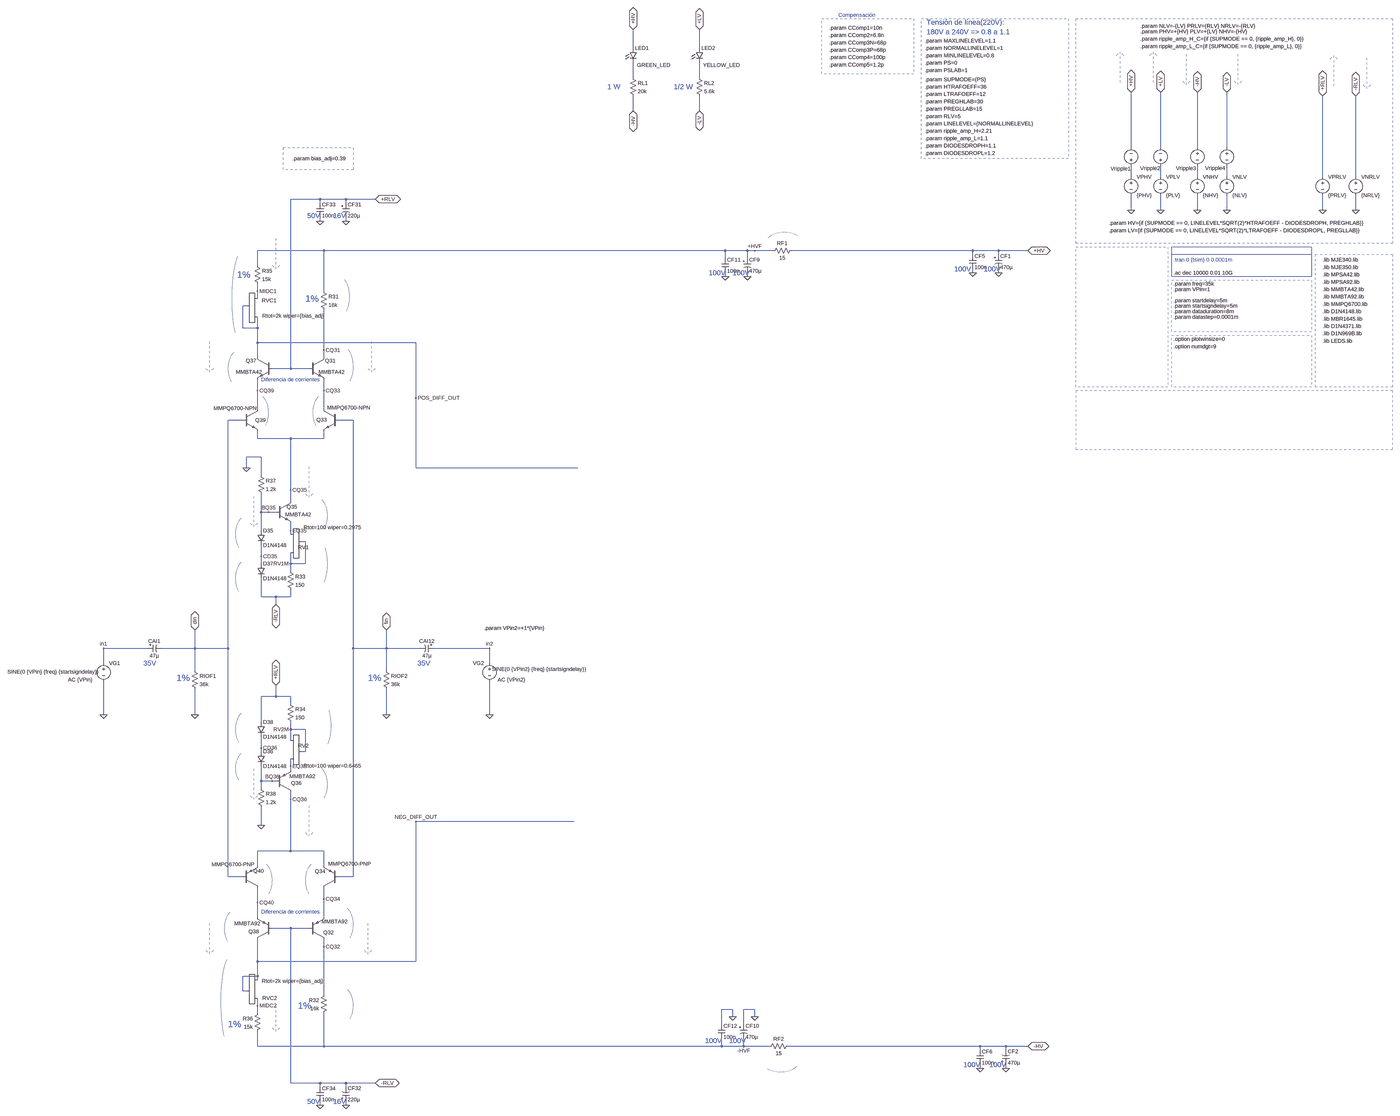
[diagram p0: schematic amplifier_V2.1_diff.asc, whole sheet]
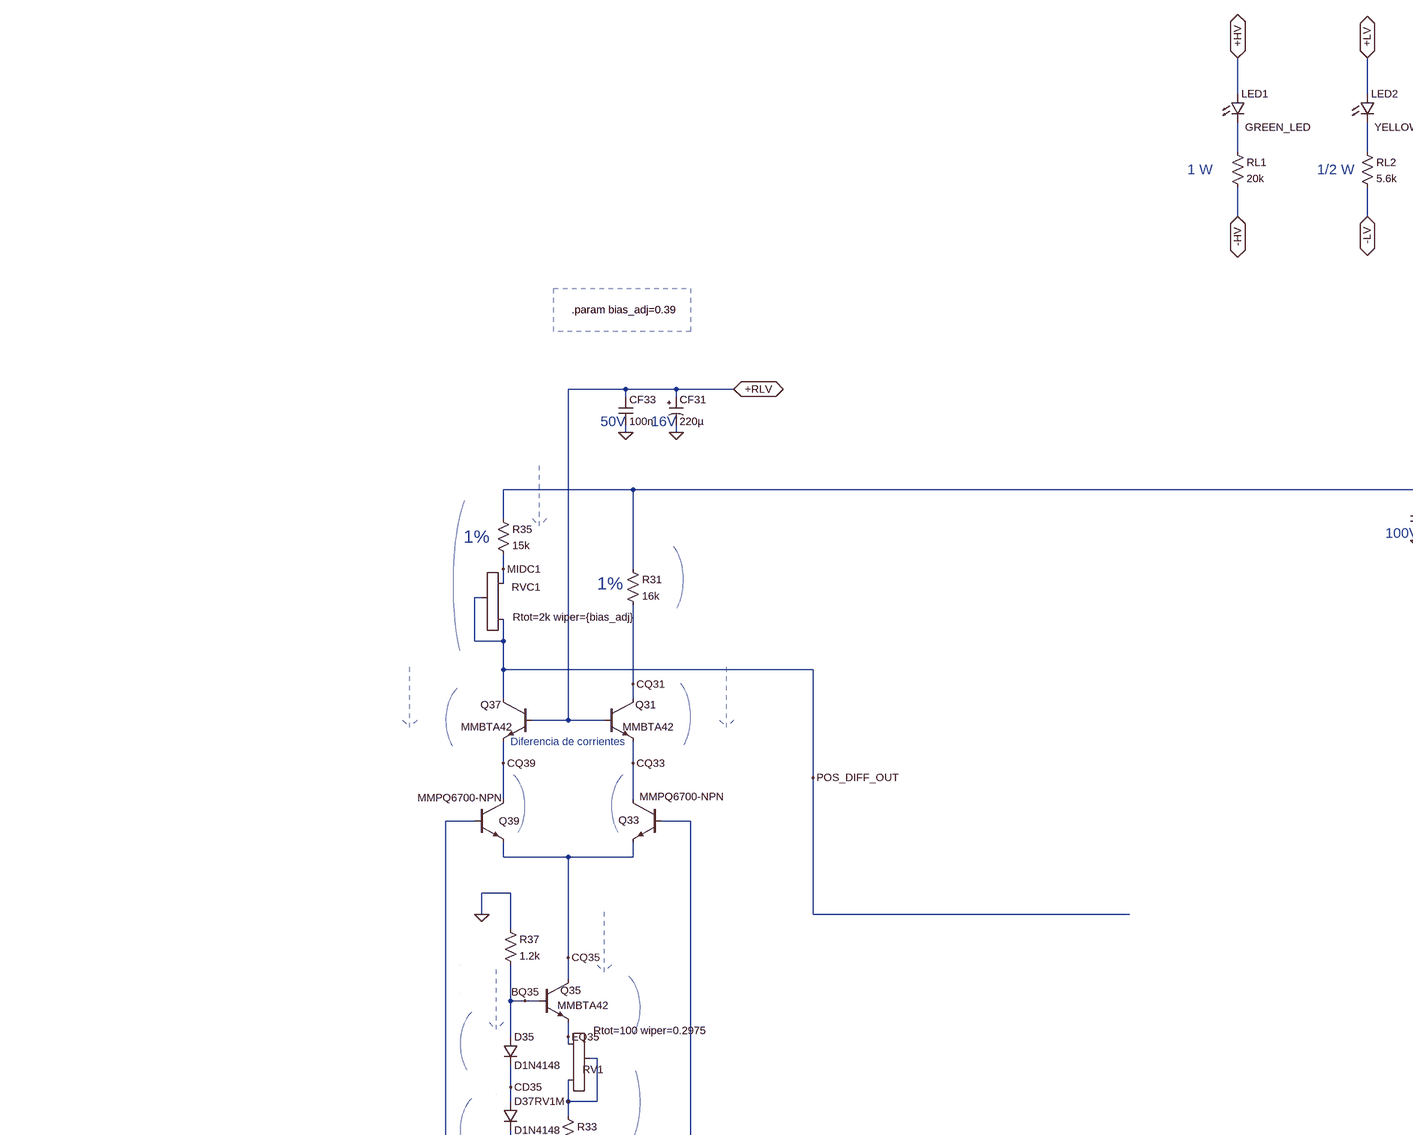
[diagram p1: schematic amplifier_V2.1_diff.asc, part, row 1 of 2, column 1 of 2]
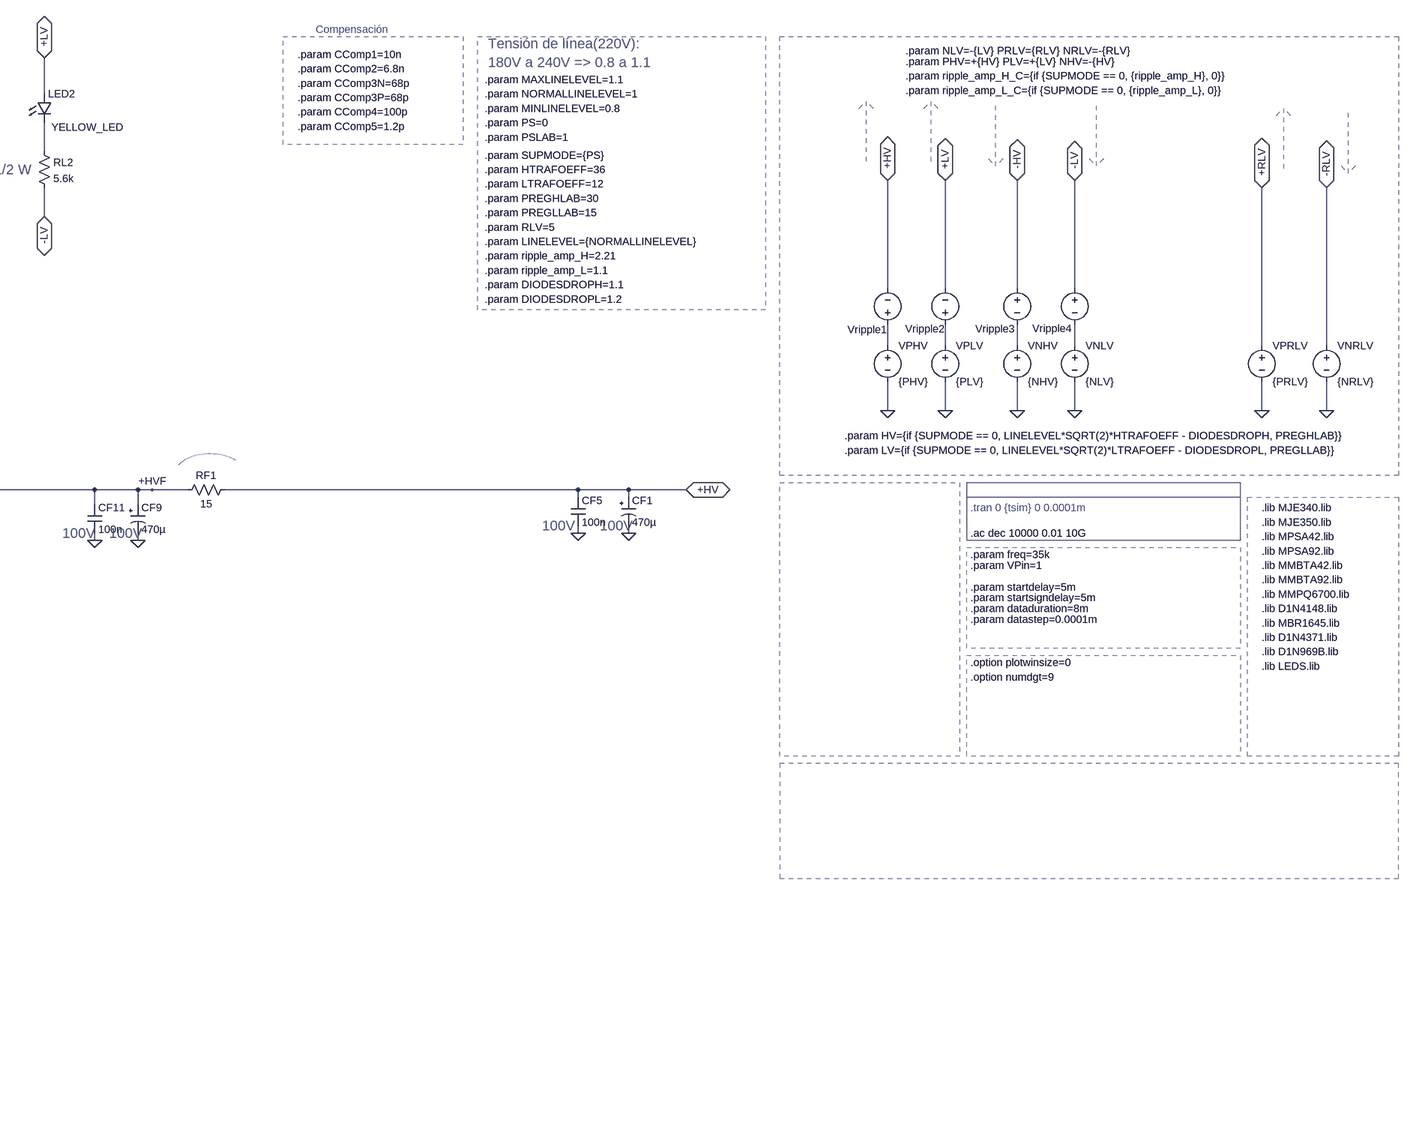
[diagram p2: schematic amplifier_V2.1_diff.asc, part, row 1 of 2, column 2 of 2]
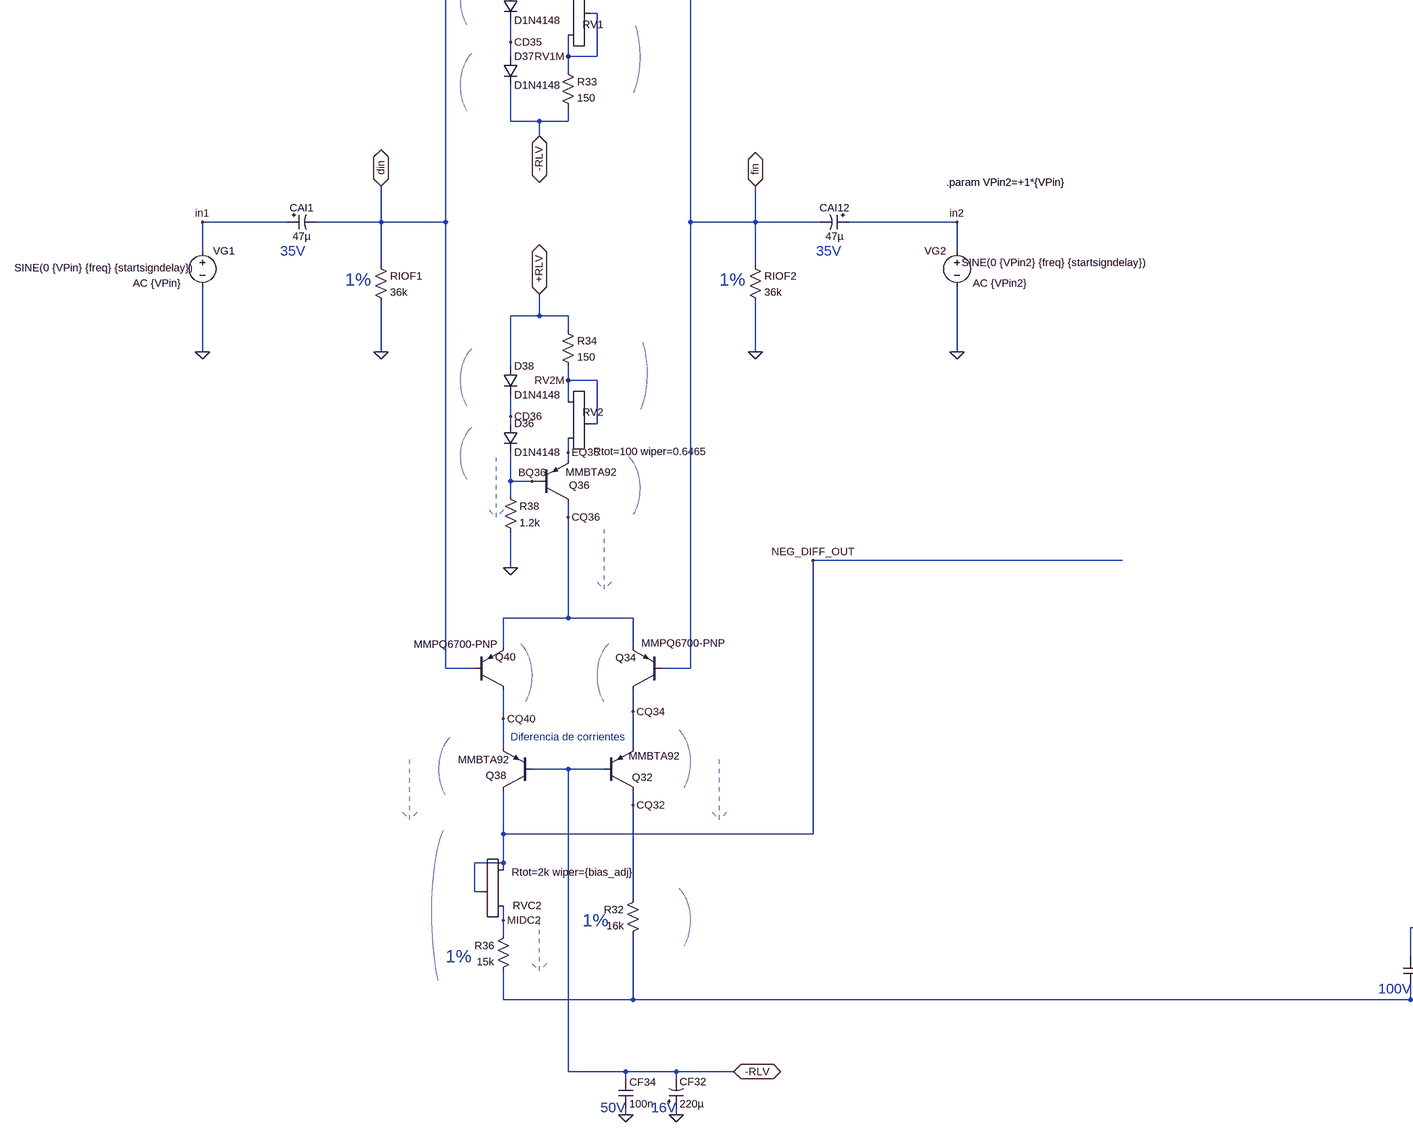
[diagram p3: schematic amplifier_V2.1_diff.asc, part, row 2 of 2, column 1 of 2]
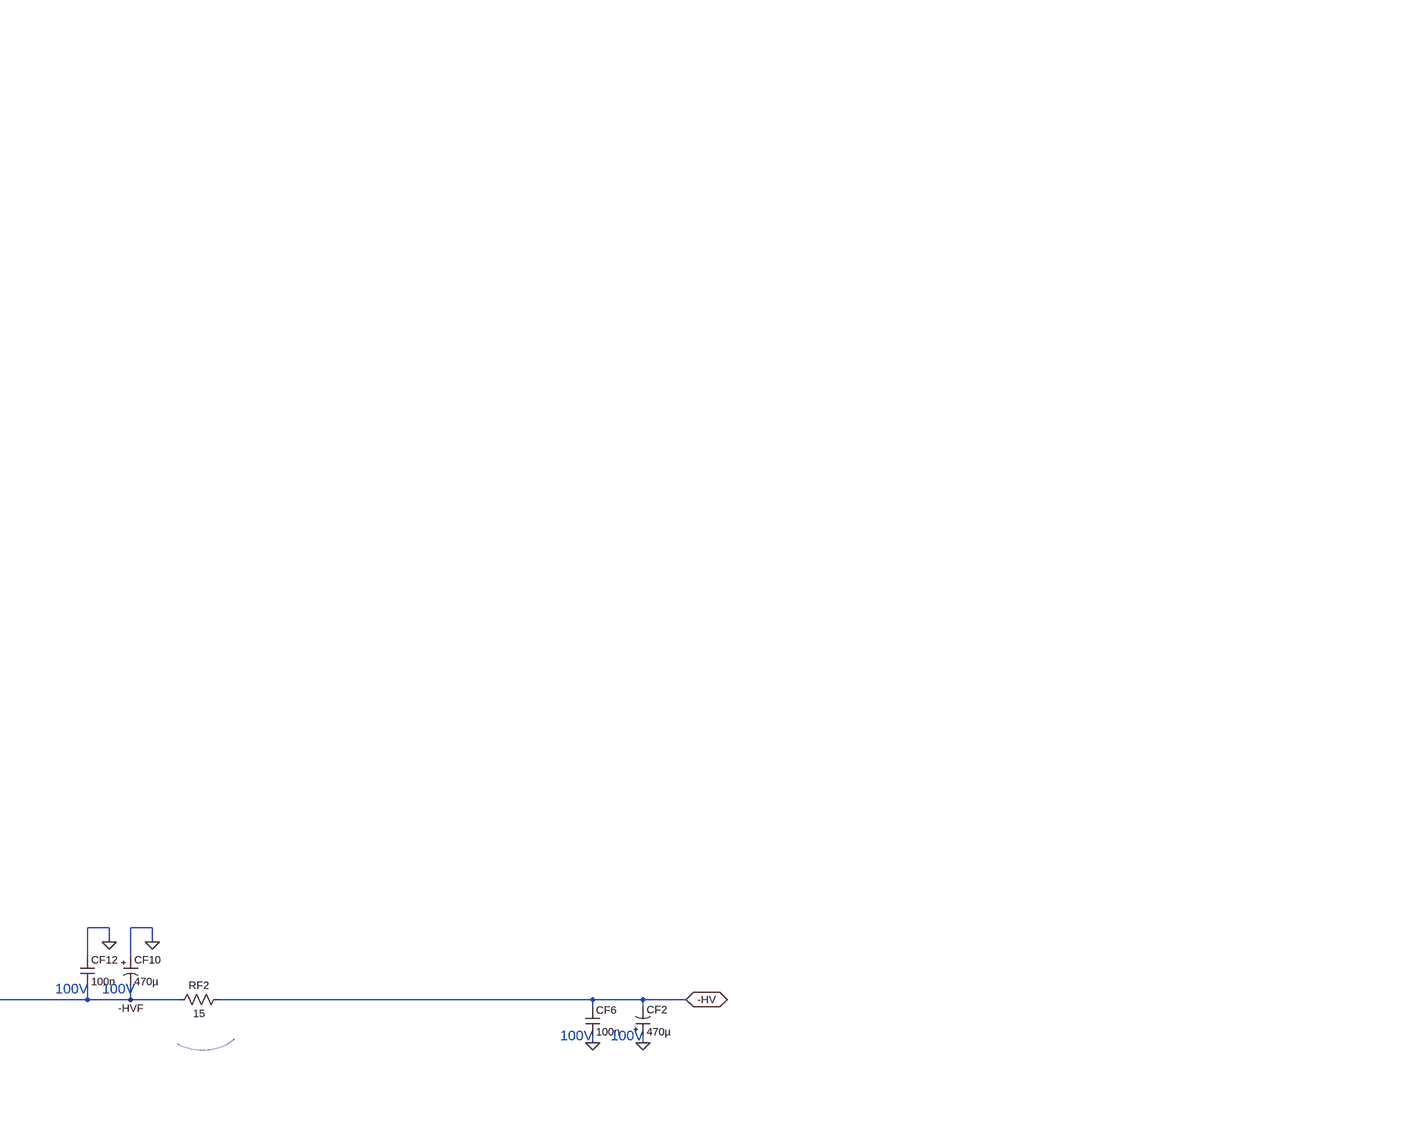
[diagram p4: schematic amplifier_V2.1_diff.asc, part, row 2 of 2, column 2 of 2]
amplifier_V2.1_diff.asc, the LTspice schematic file:
Version 4
SHEET 1 8052 2620
WIRE -528 -2480 -528 -2560
WIRE -240 -2480 -240 -2560
WIRE -528 -2352 -528 -2416
WIRE -240 -2352 -240 -2416
WIRE -528 -2208 -528 -2272
WIRE -240 -2208 -240 -2272
WIRE 1840 -2048 1840 -2288
WIRE 1968 -2048 1968 -2288
WIRE 2128 -2048 2128 -2288
WIRE 2256 -2048 2256 -2288
WIRE 1840 -1920 1840 -1968
WIRE 1968 -1920 1968 -1968
WIRE 2128 -1920 2128 -1968
WIRE 2256 -1920 2256 -1968
WIRE 2672 -1920 2672 -2272
WIRE 2816 -1920 2816 -2272
WIRE -1888 -1824 -2016 -1824
WIRE -1776 -1824 -1888 -1824
WIRE -1648 -1824 -1776 -1824
WIRE -1888 -1808 -1888 -1824
WIRE -1776 -1808 -1776 -1824
WIRE 1840 -1776 1840 -1840
WIRE 1968 -1776 1968 -1840
WIRE 2128 -1776 2128 -1840
WIRE 2256 -1776 2256 -1840
WIRE 2672 -1776 2672 -1840
WIRE 2816 -1776 2816 -1840
WIRE -1888 -1728 -1888 -1744
WIRE -1776 -1728 -1776 -1744
WIRE -1872 -1600 -2160 -1600
WIRE -128 -1600 -1872 -1600
WIRE -32 -1600 -128 -1600
WIRE 0 -1600 -32 -1600
WIRE 80 -1600 0 -1600
WIRE 1152 -1600 160 -1600
WIRE 1264 -1600 1152 -1600
WIRE 1392 -1600 1264 -1600
WIRE 1152 -1584 1152 -1600
WIRE 1264 -1584 1264 -1600
WIRE -128 -1568 -128 -1600
WIRE -32 -1568 -32 -1600
WIRE -2160 -1536 -2160 -1600
WIRE 1152 -1504 1152 -1520
WIRE 1264 -1504 1264 -1520
WIRE -128 -1488 -128 -1504
WIRE -32 -1488 -32 -1504
WIRE -2160 -1424 -2160 -1456
WIRE -1872 -1424 -1872 -1600
WIRE -2160 -1392 -2160 -1424
WIRE -2208 -1360 -2224 -1360
WIRE -2224 -1264 -2224 -1360
WIRE -2160 -1264 -2160 -1312
WIRE -2160 -1264 -2224 -1264
WIRE -2160 -1200 -2160 -1264
WIRE -1472 -1200 -2160 -1200
WIRE -1872 -1168 -1872 -1344
WIRE -2160 -1136 -2160 -1200
WIRE -1872 -1136 -1872 -1168
WIRE -2016 -1088 -2016 -1824
WIRE -2016 -1088 -2096 -1088
WIRE -1936 -1088 -2016 -1088
WIRE -2160 -992 -2160 -1040
WIRE -1872 -992 -1872 -1040
WIRE -1472 -960 -1472 -1200
WIRE -2160 -912 -2160 -992
WIRE -1872 -912 -1872 -992
WIRE -2224 -864 -2288 -864
WIRE -1744 -864 -1808 -864
WIRE -2160 -784 -2160 -816
WIRE -2016 -784 -2160 -784
WIRE -1872 -784 -1872 -816
WIRE -1872 -784 -2016 -784
WIRE -2144 -704 -2208 -704
WIRE -2208 -656 -2208 -704
WIRE -1472 -656 -1472 -960
WIRE -768 -656 -1472 -656
WIRE -2144 -624 -2144 -704
WIRE -2016 -560 -2016 -784
WIRE -2016 -512 -2016 -560
WIRE -2144 -464 -2144 -544
WIRE -2112 -464 -2144 -464
WIRE -2080 -464 -2112 -464
WIRE -2144 -384 -2144 -464
WIRE -2016 -384 -2016 -416
WIRE -2016 -368 -2016 -384
WIRE -1952 -336 -1968 -336
WIRE -2144 -272 -2144 -320
WIRE -2144 -240 -2144 -272
WIRE -2016 -240 -2016 -288
WIRE -1952 -240 -1952 -336
WIRE -1952 -240 -2016 -240
WIRE -2016 -208 -2016 -240
WIRE -2144 -96 -2144 -176
WIRE -2080 -96 -2144 -96
WIRE -2016 -96 -2016 -128
WIRE -2016 -96 -2080 -96
WIRE -2080 -64 -2080 -96
WIRE -2640 128 -2912 128
WIRE -2432 128 -2432 48
WIRE -2432 128 -2576 128
WIRE -2288 128 -2288 -864
WIRE -2288 128 -2432 128
WIRE -1744 128 -1744 -864
WIRE -1600 128 -1600 48
WIRE -1600 128 -1744 128
WIRE -1456 128 -1600 128
WIRE -1152 128 -1392 128
WIRE -2912 192 -2912 128
WIRE -1152 192 -1152 128
WIRE -2432 224 -2432 128
WIRE -1600 224 -1600 128
WIRE -2080 336 -2080 288
WIRE -2080 336 -2144 336
WIRE -2016 336 -2080 336
WIRE -2016 368 -2016 336
WIRE -2912 416 -2912 272
WIRE -2432 416 -2432 304
WIRE -1600 416 -1600 304
WIRE -1152 416 -1152 272
WIRE -2144 448 -2144 336
WIRE -2016 480 -2016 448
WIRE -1952 480 -2016 480
WIRE -2016 528 -2016 480
WIRE -2144 560 -2144 512
WIRE -2144 576 -2144 560
WIRE -1952 576 -1952 480
WIRE -1952 576 -1968 576
WIRE -2016 640 -2016 608
WIRE -2016 656 -2016 640
WIRE -2144 704 -2144 640
WIRE -2096 704 -2144 704
WIRE -2080 704 -2096 704
WIRE -2144 736 -2144 704
WIRE -2016 784 -2016 752
WIRE -784 880 -1472 880
WIRE -2144 896 -2144 816
WIRE -2016 1008 -2016 784
WIRE -2016 1008 -2160 1008
WIRE -1872 1008 -2016 1008
WIRE -2160 1072 -2160 1008
WIRE -1872 1072 -1872 1008
WIRE -2288 1120 -2288 128
WIRE -2224 1120 -2288 1120
WIRE -1744 1120 -1744 128
WIRE -1744 1120 -1808 1120
WIRE -1872 1216 -1872 1168
WIRE -2160 1232 -2160 1168
WIRE -2160 1296 -2160 1232
WIRE -1872 1296 -1872 1216
WIRE -2016 1344 -2096 1344
WIRE -1936 1344 -2016 1344
WIRE -1872 1424 -1872 1392
WIRE -2160 1488 -2160 1392
WIRE -1472 1488 -1472 880
WIRE -1472 1488 -2160 1488
WIRE -2160 1552 -2160 1488
WIRE -2160 1552 -2224 1552
WIRE -2160 1568 -2160 1552
WIRE -2224 1616 -2224 1552
WIRE -2208 1616 -2224 1616
WIRE -1872 1632 -1872 1424
WIRE -2160 1680 -2160 1648
WIRE -96 1696 -144 1696
WIRE 0 1696 -48 1696
WIRE -2160 1712 -2160 1680
WIRE -96 1728 -96 1696
WIRE 0 1728 0 1696
WIRE -144 1760 -144 1696
WIRE -48 1760 -48 1696
WIRE -2160 1856 -2160 1792
WIRE -1872 1856 -1872 1712
WIRE -1872 1856 -2160 1856
WIRE -144 1856 -144 1824
WIRE -144 1856 -1872 1856
WIRE -48 1856 -48 1824
WIRE -48 1856 -144 1856
WIRE 64 1856 -48 1856
WIRE 1184 1856 144 1856
WIRE 1296 1856 1184 1856
WIRE 1392 1856 1296 1856
WIRE 1184 1872 1184 1856
WIRE 1296 1872 1296 1856
WIRE 1184 1952 1184 1936
WIRE 1296 1952 1296 1936
WIRE -2016 2016 -2016 1344
WIRE -1888 2016 -2016 2016
WIRE -1776 2016 -1888 2016
WIRE -1648 2016 -1776 2016
WIRE -1888 2032 -1888 2016
WIRE -1776 2032 -1776 2016
WIRE -1888 2112 -1888 2096
WIRE -1776 2112 -1776 2096
FLAG -2432 416 0
FLAG -1648 -1824 +RLV
IOPIN -1648 -1824 BiDir
FLAG -1648 2016 -RLV
IOPIN -1648 2016 BiDir
FLAG -2080 -64 -RLV
IOPIN -2080 -64 BiDir
FLAG -2080 288 +RLV
IOPIN -2080 288 BiDir
FLAG 1392 1856 -HV
IOPIN 1392 1856 BiDir
FLAG -2912 416 0
FLAG -2912 128 in1
FLAG 1264 -1504 0
FLAG -2144 896 0
FLAG -2208 -656 0
FLAG -1472 -960 POS_DIFF_OUT
FLAG -1472 880 NEG_DIFF_OUT
FLAG 1152 -1504 0
FLAG 1296 1952 0
FLAG 1184 1952 0
FLAG -1776 -1728 0
FLAG -1888 -1728 0
FLAG -1776 2112 0
FLAG -1888 2112 0
FLAG 1840 -1776 0
FLAG 1968 -1776 0
FLAG 2128 -1776 0
FLAG 2256 -1776 0
FLAG 1968 -2288 +LV
IOPIN 1968 -2288 BiDir
FLAG 2128 -2288 -HV
IOPIN 2128 -2288 BiDir
FLAG 2256 -2288 -LV
IOPIN 2256 -2288 BiDir
FLAG 2672 -1776 0
FLAG 2672 -2272 +RLV
IOPIN 2672 -2272 BiDir
FLAG 2816 -1776 0
FLAG 2816 -2272 -RLV
IOPIN 2816 -2272 BiDir
FLAG -2016 -560 CQ35
FLAG -2016 784 CQ36
FLAG -2144 -272 CD35
FLAG -2144 560 CD36
FLAG -2096 704 BQ36
FLAG -2432 48 din
IOPIN -2432 48 BiDir
FLAG -1600 48 fin
IOPIN -1600 48 BiDir
FLAG -2160 1232 CQ40
FLAG -2160 -992 CQ39
FLAG 1392 -1600 +HV
IOPIN 1392 -1600 BiDir
FLAG -240 -2560 +LV
IOPIN -240 -2560 BiDir
FLAG -240 -2208 -LV
IOPIN -240 -2208 BiDir
FLAG -528 -2560 +HV
IOPIN -528 -2560 BiDir
FLAG -528 -2208 -HV
IOPIN -528 -2208 BiDir
FLAG -1872 1216 CQ34
FLAG -1872 1424 CQ32
FLAG -1872 -992 CQ33
FLAG -1872 -1168 CQ31
FLAG 0 1728 0
FLAG -48 1856 -HVF
FLAG -32 -1488 0
FLAG 0 -1600 +HVF
FLAG 1840 -2288 +HV
IOPIN 1840 -2288 BiDir
FLAG -2016 -384 EQ35
FLAG -2016 640 EQ36
FLAG -128 -1488 0
FLAG -96 1728 0
FLAG -2016 -240 RV1M
FLAG -2016 480 RV2M
FLAG -2112 -464 BQ35
FLAG -2160 -1424 MIDC1
FLAG -2160 1680 MIDC2
FLAG -1152 416 0
FLAG -1152 128 in2
FLAG -1600 416 0
DATAFLAG -2016 -688 ""
DATAFLAG -2016 912 ""
DATAFLAG -1696 128 ""
DATAFLAG 1328 -1600 ""
DATAFLAG -2096 -96 ""
DATAFLAG -2032 336 ""
DATAFLAG -2320 128 ""
DATAFLAG 1312 1856 ""
DATAFLAG -1680 -1824 ""
DATAFLAG -1680 2016 ""
DATAFLAG -2368 -1168 "Ic(Q37)"
DATAFLAG -2176 -496 "I(D35)"
DATAFLAG -2176 688 "I(D36)"
DATAFLAG -1936 -624 "Ic(Q35)"
DATAFLAG -1936 848 "-Ic(Q36)"
DATAFLAG -2368 1392 "-Ic(Q40)"
DATAFLAG 1792 -2368 "-I(Vphv)"
DATAFLAG 1936 -2416 "-I(Vplv)"
DATAFLAG 2080 -2368 "I(vnhv)"
DATAFLAG 2864 -2400 "I(Vnrlv)"
DATAFLAG 2720 -2400 "-I(Vprlv)"
DATAFLAG 2304 -2416 "I(Vnlv)"
DATAFLAG -2288 -1088 "V(POS_DIFF_OUT)-V(CQ39)"
DATAFLAG -2112 -880 "V(CQ39)-V(CQ35)"
DATAFLAG -1920 -880 "V(CQ33)-V(CQ35)"
DATAFLAG -1856 -448 "V(CQ35)-V(EQ35)"
DATAFLAG -1856 720 "V(EQ36)-V(CQ36)"
DATAFLAG -2256 -176 "V(CD35)-V(-rlv)"
DATAFLAG -2256 -368 "V(BQ35)-V(CD35)"
DATAFLAG -2256 480 "V(+rlv)-V(CD36)"
DATAFLAG -2256 640 "V(CD36)-V(BQ36)"
DATAFLAG -2096 1136 "-V(CQ40)+V(CQ36)"
DATAFLAG -1952 1136 "-V(CQ34)+V(CQ36)"
DATAFLAG -2304 1344 "V(CQ40)-V(NEG_DIFF_OUT)"
DATAFLAG -2320 1664 "V(NEG_DIFF_OUT)-V(-HVF)"
DATAFLAG -2272 -1520 "V(+HVF)-V(POS_DIFF_OUT)"
DATAFLAG -2016 -992 "Ic(Q37)-Ic(Q31)"
DATAFLAG -2016 1312 "Ic(Q38)-Ic(Q32)"
DATAFLAG -1680 1360 "-Ic(Q34)"
DATAFLAG -2080 -1616 "I(R35)"
DATAFLAG -2080 1728 "-I(R36)"
DATAFLAG -1952 1344 ""
DATAFLAG -304 -1600 ""
DATAFLAG -304 1856 ""
DATAFLAG -1728 1856 ""
DATAFLAG -1744 -1600 ""
DATAFLAG 112 1968 "-V(-HV)+V(-HVF)"
DATAFLAG -656 1856 ""
DATAFLAG -640 -1600 ""
DATAFLAG 128 -1680 "V(+HV)-V(+HVF)"
DATAFLAG -2752 128 ""
DATAFLAG -1664 -1168 "Ic(Q31)"
DATAFLAG -1744 -1088 "V(CQ31)-V(CQ33)"
DATAFLAG -1744 1328 "V(CQ34)-V(CQ32)"
DATAFLAG -1744 1696 "V(CQ32)-V(-HVF)"
DATAFLAG -1760 -1440 "V(+HVF)-V(CQ31)"
DATAFLAG -1856 -240 "V(EQ35)-V(-rlv)"
DATAFLAG -1840 464 "-V(EQ36)+V(+rlv)"
DATAFLAG -1312 128 ""
SYMBOL res -2448 208 R0
SYMATTR InstName RIOF1
SYMATTR Value 36k
SYMBOL npn -2224 -912 R0
WINDOW 3 -127 -3 Left 2
WINDOW 0 54 48 Left 2
SYMATTR Value MMPQ6700-NPN
SYMATTR InstName Q39
SYMBOL npn -1808 -912 M0
WINDOW 0 50 47 Left 2
WINDOW 3 -138 -6 Left 2
SYMATTR InstName Q33
SYMATTR Value MMPQ6700-NPN
SYMBOL pnp -2224 1168 M180
WINDOW 3 -135 102 Left 2
WINDOW 0 46 73 Left 2
SYMATTR Value MMPQ6700-PNP
SYMATTR InstName Q40
SYMBOL pnp -1808 1168 R180
WINDOW 0 57 72 Left 2
WINDOW 3 -141 104 Left 2
SYMATTR InstName Q34
SYMATTR Value MMPQ6700-PNP
SYMBOL res -2160 -640 R0
SYMATTR InstName R37
SYMATTR Value 1.2k
SYMBOL npn -2080 -512 R0
WINDOW 0 47 25 Left 2
WINDOW 3 40 58 Left 2
SYMATTR InstName Q35
SYMATTR Value MMBTA42
SYMBOL pnp -2080 752 M180
WINDOW 0 66 39 Left 2
WINDOW 3 58 68 Left 2
SYMATTR InstName Q36
SYMATTR Value MMBTA92
SYMBOL res -2160 720 R0
SYMATTR InstName R38
SYMATTR Value 1.2k
SYMBOL voltage -2912 176 R0
WINDOW 3 -418 54 Left 2
WINDOW 123 -155 88 Left 2
WINDOW 39 0 0 Left 2
SYMATTR Value SINE(0 {VPin} {freq} {startsigndelay})
SYMATTR Value2 AC {VPin}
SYMATTR InstName VG1
SYMBOL cap 1136 -1584 R0
SYMATTR InstName CF5
SYMATTR Value 100n
SYMBOL diode -2160 448 R0
SYMATTR InstName D38
SYMATTR Value D1N4148
SYMBOL diode -2160 -384 R0
SYMATTR InstName D35
SYMATTR Value D1N4148
SYMBOL polcap 1248 -1584 R0
SYMATTR InstName CF1
SYMATTR Value 470µ
SYMBOL cap 1168 1872 R0
SYMATTR InstName CF6
SYMATTR Value 100n
SYMBOL polcap 1280 1936 M180
WINDOW 0 24 57 Left 2
WINDOW 3 24 8 Left 2
SYMATTR InstName CF2
SYMATTR Value 470µ
SYMBOL cap -1904 -1808 R0
SYMATTR InstName CF33
SYMATTR Value 100n
SYMBOL polcap -1792 -1808 R0
SYMATTR InstName CF31
SYMATTR Value 220µ
SYMBOL cap -1904 2032 R0
SYMATTR InstName CF34
SYMATTR Value 100n
SYMBOL polcap -1792 2096 M180
WINDOW 0 24 57 Left 2
WINDOW 3 24 8 Left 2
SYMATTR InstName CF32
SYMATTR Value 220µ
SYMBOL polcap -2640 112 M90
WINDOW 0 0 32 VBottom 2
WINDOW 3 32 32 VTop 2
SYMATTR InstName CAI1
SYMATTR Value 47µ
SYMBOL voltage 1840 -1936 R0
SYMATTR InstName VPHV
SYMATTR Value {PHV}
SYMBOL voltage 1968 -1936 R0
SYMATTR InstName VPLV
SYMATTR Value {PLV}
SYMBOL voltage 2128 -1936 R0
SYMATTR InstName VNHV
SYMATTR Value {NHV}
SYMBOL voltage 2256 -1936 R0
SYMATTR InstName VNLV
SYMATTR Value {NLV}
SYMBOL voltage 2672 -1936 R0
SYMATTR InstName VPRLV
SYMATTR Value {PRLV}
SYMBOL voltage 2816 -1936 R0
SYMATTR InstName VNRLV
SYMATTR Value {NRLV}
SYMBOL npn -2096 -1136 M0
WINDOW 0 69 14 Left 2
WINDOW 3 44 63 Left 2
SYMATTR InstName Q37
SYMATTR Value MMBTA42
SYMBOL res -2176 -1552 R0
SYMATTR InstName R35
SYMATTR Value 15k
SYMBOL pnp -2096 1392 R180
WINDOW 0 57 34 Left 2
WINDOW 3 51 69 Left 2
SYMATTR InstName Q38
SYMATTR Value MMBTA92
SYMBOL res -2144 1696 M0
SYMATTR InstName R36
SYMATTR Value 15k
SYMBOL voltage 2256 -2064 R0
WINDOW 123 0 0 Left 0
WINDOW 39 0 0 Left 0
WINDOW 0 -94 105 Left 2
WINDOW 3 -94 77 Invisible 2
SYMATTR InstName Vripple4
SYMATTR Value PULSE({ripple_amp_L_C} 0 0 1m 9m 0 10m)
SYMBOL voltage 2128 -2064 R0
WINDOW 123 0 0 Left 0
WINDOW 39 0 0 Left 0
WINDOW 0 -93 106 Left 2
WINDOW 3 -93 78 Invisible 2
SYMATTR InstName Vripple3
SYMATTR Value PULSE({ripple_amp_H_C} 0 0 1m 9m 0 10m)
SYMBOL voltage 1840 -1952 R180
WINDOW 123 0 0 Left 0
WINDOW 39 0 0 Left 0
WINDOW 0 1 4 Left 2
WINDOW 3 1 -24 Invisible 2
SYMATTR InstName Vripple1
SYMATTR Value PULSE({ripple_amp_H_C} 0 0 1m 9m 0 10m)
SYMBOL voltage 1968 -1952 R180
WINDOW 123 0 0 Left 0
WINDOW 39 0 0 Left 0
WINDOW 0 0 6 Left 2
WINDOW 3 0 -22 Invisible 2
SYMATTR InstName Vripple2
SYMATTR Value PULSE({ripple_amp_L_C} 0 0 1m 9m 0 10m)
SYMBOL diode -2160 -240 R0
SYMATTR InstName D37
SYMATTR Value D1N4148
SYMBOL diode -2160 576 R0
SYMATTR InstName D36
SYMATTR Value D1N4148
SYMBOL npn -1936 -1136 R0
WINDOW 0 69 14 Left 2
WINDOW 3 41 63 Left 2
SYMATTR InstName Q31
SYMATTR Value MMBTA42
SYMBOL res -1888 -1440 R0
SYMATTR InstName R31
SYMATTR Value 16k
SYMBOL pnp -1936 1392 M180
WINDOW 0 62 30 Left 2
WINDOW 3 54 77 Left 2
SYMATTR InstName Q32
SYMATTR Value MMBTA92
SYMBOL res -1856 1616 M0
SYMATTR InstName R32
SYMATTR Value 16k
SYMBOL LED -256 -2480 R0
WINDOW 3 32 74 Left 2
SYMATTR Value YELLOW_LED
SYMATTR InstName LED2
SYMBOL res -256 -2368 R0
SYMATTR InstName RL2
SYMATTR Value 5.6k
SYMBOL LED -544 -2480 R0
WINDOW 3 32 74 Left 2
SYMATTR Value GREEN_LED
SYMATTR InstName LED1
SYMBOL res -544 -2368 R0
SYMATTR InstName RL1
SYMATTR Value 20k
SYMBOL res 160 1840 R90
WINDOW 0 0 56 VBottom 2
WINDOW 3 32 56 VTop 2
SYMATTR InstName RF2
SYMATTR Value 15
SYMBOL polcap -64 1760 R0
SYMATTR InstName CF10
SYMATTR Value 470µ
SYMBOL res 176 -1616 R90
WINDOW 0 0 56 VBottom 2
WINDOW 3 32 56 VTop 2
SYMATTR InstName RF1
SYMATTR Value 15
SYMBOL polcap -48 -1568 R0
SYMATTR InstName CF9
SYMATTR Value 470µ
SYMBOL potentiometer_standard -2032 -272 M180
WINDOW 0 48 39 Left 2
WINDOW 39 48 112 Invisible 2
WINDOW 38 48 114 Left 2
SYMATTR InstName RV1
SYMATTR SpiceLine Rtap=0 tap=0.5
SYMATTR Value Rtot=100 wiper=0.2975
SYMBOL res -2032 -224 R0
SYMATTR InstName R33
SYMATTR Value 150
SYMBOL potentiometer_standard -2032 512 R0
WINDOW 0 48 39 Left 2
WINDOW 39 48 112 Invisible 2
WINDOW 38 48 114 Left 2
SYMATTR InstName RV2
SYMATTR SpiceLine Rtap=0 tap=0.5
SYMATTR Value Rtot=100 wiper=0.6465
SYMBOL res -2032 352 R0
SYMATTR InstName R34
SYMATTR Value 150
SYMBOL cap -144 -1568 R0
SYMATTR InstName CF11
SYMATTR Value 100n
SYMBOL cap -160 1824 M180
WINDOW 0 24 56 Left 2
WINDOW 3 24 8 Left 2
SYMATTR InstName CF12
SYMATTR Value 100n
SYMBOL potentiometer_standard -2144 -1296 R180
WINDOW 0 -66 88 Left 2
WINDOW 39 48 112 Invisible 2
WINDOW 38 -83 56 Left 2
WINDOW 3 -274 21 Left 2
SYMATTR InstName RVC1
SYMATTR SpiceLine Rtap=0 tap=0.5
SYMATTR Value Rtot=2k wiper={bias_adj}
SYMBOL potentiometer_standard -2144 1552 M0
WINDOW 0 -69 95 Left 2
WINDOW 39 48 112 Invisible 2
WINDOW 38 -83 56 Left 2
WINDOW 3 -272 21 Left 2
SYMATTR InstName RVC2
SYMATTR SpiceLine Rtap=0 tap=0.5
SYMATTR Value Rtot=2k wiper={bias_adj}
SYMBOL voltage -1152 176 M0
WINDOW 3 -421 42 Left 2
WINDOW 123 -155 88 Left 2
WINDOW 39 0 0 Left 2
SYMATTR Value SINE(0 {VPin2} {freq} {startsigndelay})
SYMATTR Value2 AC {VPin2}
SYMATTR InstName VG2
SYMBOL polcap -1392 112 R90
WINDOW 0 0 32 VBottom 2
WINDOW 3 32 32 VTop 2
SYMATTR InstName CAI12
SYMATTR Value 47µ
SYMBOL res -1616 208 R0
SYMATTR InstName RIOF2
SYMATTR Value 36k
TEXT -2144 1272 Left 2 ;Diferencia de corrientes
TEXT -2144 -1040 Left 2 ;Diferencia de corrientes
TEXT 2672 -1304 Left 2 !.lib MBR1645.lib
TEXT 2672 -1560 Left 2 !.lib MJE340.lib
TEXT 2672 -1528 Left 2 !.lib MJE350.lib
TEXT 2672 -1336 Left 2 !.lib D1N4148.lib
TEXT 2672 -1432 Left 2 !.lib MMBTA42.lib
TEXT 2672 -1400 Left 2 !.lib MMBTA92.lib
TEXT 2672 -1368 Left 2 !.lib MMPQ6700.lib
TEXT 1880 -2552 Left 2 !.param PHV=+{HV} PLV=+{LV} NHV=-{HV}
TEXT 1744 -1720 Left 2 !.param HV={if {SUPMODE == 0, LINELEVEL*SQRT(2)*HTRAFOEFF - DIODESDROPH, PREGHLAB}}
TEXT 1744 -1688 Left 2 !.param LV={if {SUPMODE == 0, LINELEVEL*SQRT(2)*LTRAFOEFF - DIODESDROPL, PREGLLAB}}
TEXT 944 -2184 Left 2 !.param RLV=5
TEXT 1880 -2576 Left 2 !.param NLV=-{LV} PRLV={RLV} NRLV=-{RLV}
TEXT 944 -2312 Left 2 !.param HTRAFOEFF=36
TEXT 944 -2280 Left 2 !.param LTRAFOEFF=12
TEXT 944 -2152 Left 2 !.param LINELEVEL={NORMALLINELEVEL}
TEXT 952 -2592 Left 3 ;Tensión de línea(220V):\n180V a 240V => 0.8 a 1.1
TEXT 944 -2512 Left 2 !.param MAXLINELEVEL=1.1
TEXT 944 -2448 Left 2 !.param MINLINELEVEL=0.8
TEXT 2672 -1272 Left 2 !.lib D1N4371.lib
TEXT 944 -2480 Left 2 !.param NORMALLINELEVEL=1
TEXT 944 -2344 Left 2 !.param SUPMODE={PS}
TEXT 944 -2248 Left 2 !.param PREGHLAB=30
TEXT 944 -2216 Left 2 !.param PREGLLAB=15
TEXT 528 -2568 Left 2 !.param CComp1=10n
TEXT 528 -2504 Left 2 !.param CComp3N=68p
TEXT 528 -2440 Left 2 !.param CComp4=100p
TEXT 568 -2624 Left 2 ;Compensación
TEXT 528 -2472 Left 2 !.param CComp3P=68p
TEXT 528 -2408 Left 2 !.param CComp5=1.2p
TEXT 528 -2536 Left 2 !.param CComp2=6.8n
TEXT 2672 -1240 Left 2 !.lib D1N969B.lib
TEXT 944 -2056 Left 2 !.param DIODESDROPH=1.1
TEXT 944 -2024 Left 2 !.param DIODESDROPL=1.2
TEXT 1880 -2520 Left 2 !.param ripple_amp_H_C={if {SUPMODE == 0, {ripple_amp_H}, 0}}
TEXT 1880 -2488 Left 2 !.param ripple_amp_L_C={if {SUPMODE == 0, {ripple_amp_L}, 0}}
TEXT 944 -2120 Left 2 !.param ripple_amp_H=2.21
TEXT 944 -2088 Left 2 !.param ripple_amp_L=1.1
TEXT 944 -2416 Left 2 !.param PS=0
TEXT 944 -2384 Left 2 !.param PSLAB=1
TEXT -352 -2312 Left 3 ;1/2 W
TEXT -640 -2312 Left 3 ;1 W
TEXT 2672 -1208 Left 2 !.lib LEDS.lib
TEXT -2512 256 Left 4 ;1%
TEXT -2288 1760 Left 4 ;1%
TEXT 1072 -1520 Left 3 ;100V
TEXT 1200 -1520 Left 3 ;100V
TEXT 1112 1936 Left 3 ;100V
TEXT 1224 1936 Left 3 ;100V
TEXT -96 -1504 Left 3 ;100V
TEXT -200 -1504 Left 3 ;100V
TEXT -112 1832 Left 3 ;100V
TEXT -216 1832 Left 3 ;100V
TEXT -1832 -1752 Left 3 ;16V
TEXT -1944 -1752 Left 3 ;50V
TEXT -1832 2096 Left 3 ;16V
TEXT -1944 2096 Left 3 ;50V
TEXT 2672 -1496 Left 2 !.lib MPSA42.lib
TEXT 2672 -1464 Left 2 !.lib MPSA92.lib
TEXT -1952 -1392 Left 4 ;1%
TEXT -2248 -1496 Left 4 ;1%
TEXT -1984 1680 Left 4 ;1%
TEXT -2008 -2000 Left 2 !.param bias_adj=0.39
TEXT 2024 -1216 Left 2 !.option plotwinsize=0
TEXT 2024 -1184 Left 2 !.option numdgt=9
TEXT 2024 -1560 Left 2 ;.tran 0 {tsim} 0 0.0001m
TEXT -2656 192 Left 3 ;35V
TEXT -1408 192 Right 3 ;35V
TEXT -1680 256 Left 4 ;1%
TEXT 2024 -1456 Left 2 !.param freq=35k
TEXT 2024 -1504 Left 2 !.ac dec 10000 0.01 10G
TEXT 2024 -1432 Left 2 !.param VPin=1
TEXT 2024 -1384 Left 2 !.param startdelay=5m
TEXT 2024 -1360 Left 2 !.param startsigndelay=5m
TEXT 2024 -1336 Left 2 !.param dataduration=8m
TEXT 2024 -1312 Left 2 !.param datastep=0.0001m
TEXT -1176 40 Left 2 !.param VPin2=+1*{VPin}
LINE Normal -2368 -1072 -2368 -1216 2
LINE Normal -2368 -1072 -2368 -1072 2
LINE Normal -2368 -1072 -2368 -1072 2
LINE Normal -2384 -1088 -2368 -1072 2
LINE Normal -2384 -1088 -2384 -1088 2
LINE Normal -2352 -1088 -2368 -1072 2
LINE Normal -2176 -400 -2176 -544 2
LINE Normal -2176 -400 -2176 -400 2
LINE Normal -2176 -400 -2176 -400 2
LINE Normal -2192 -416 -2176 -400 2
LINE Normal -2192 -416 -2192 -416 2
LINE Normal -2160 -416 -2176 -400 2
LINE Normal -2176 784 -2176 640 2
LINE Normal -2176 784 -2176 784 2
LINE Normal -2176 784 -2176 784 2
LINE Normal -2192 768 -2176 784 2
LINE Normal -2192 768 -2192 768 2
LINE Normal -2160 768 -2176 784 2
LINE Normal -1936 -528 -1936 -672 2
LINE Normal -1936 -528 -1936 -528 2
LINE Normal -1936 -528 -1936 -528 2
LINE Normal -1952 -544 -1936 -528 2
LINE Normal -1952 -544 -1952 -544 2
LINE Normal -1920 -544 -1936 -528 2
LINE Normal -1936 944 -1936 800 2
LINE Normal -1936 944 -1936 944 2
LINE Normal -1936 944 -1936 944 2
LINE Normal -1952 928 -1936 944 2
LINE Normal -1952 928 -1952 928 2
LINE Normal -1920 928 -1936 944 2
LINE Normal -2368 1456 -2368 1312 2
LINE Normal -2368 1456 -2368 1456 2
LINE Normal -2368 1456 -2368 1456 2
LINE Normal -2384 1440 -2368 1456 2
LINE Normal -2384 1440 -2384 1440 2
LINE Normal -2352 1440 -2368 1456 2
LINE Normal 1792 -2464 1792 -2320 2
LINE Normal 1792 -2464 1792 -2464 2
LINE Normal 1792 -2464 1792 -2464 2
LINE Normal 1808 -2448 1792 -2464 2
LINE Normal 1808 -2448 1808 -2448 2
LINE Normal 1776 -2448 1792 -2464 2
LINE Normal 1936 -2464 1936 -2320 2
LINE Normal 1936 -2464 1936 -2464 2
LINE Normal 1936 -2464 1936 -2464 2
LINE Normal 1952 -2448 1936 -2464 2
LINE Normal 1952 -2448 1952 -2448 2
LINE Normal 1920 -2448 1936 -2464 2
LINE Normal 2080 -2320 2080 -2464 2
LINE Normal 2080 -2320 2080 -2320 2
LINE Normal 2080 -2320 2080 -2320 2
LINE Normal 2064 -2336 2080 -2320 2
LINE Normal 2064 -2336 2064 -2336 2
LINE Normal 2096 -2336 2080 -2320 2
LINE Normal 2864 -2304 2864 -2448 2
LINE Normal 2864 -2304 2864 -2304 2
LINE Normal 2864 -2304 2864 -2304 2
LINE Normal 2848 -2320 2864 -2304 2
LINE Normal 2848 -2320 2848 -2320 2
LINE Normal 2880 -2320 2864 -2304 2
LINE Normal 2720 -2448 2720 -2304 2
LINE Normal 2720 -2448 2720 -2448 2
LINE Normal 2720 -2448 2720 -2448 2
LINE Normal 2736 -2432 2720 -2448 2
LINE Normal 2736 -2432 2736 -2432 2
LINE Normal 2704 -2432 2720 -2448 2
LINE Normal 2304 -2320 2304 -2464 2
LINE Normal 2304 -2320 2304 -2320 2
LINE Normal 2304 -2320 2304 -2320 2
LINE Normal 2288 -2336 2304 -2320 2
LINE Normal 2288 -2336 2288 -2336 2
LINE Normal 2320 -2336 2304 -2320 2
LINE Normal -2176 -256 -2176 -256 2
LINE Normal -2176 -256 -2176 -256 2
LINE Normal -2256 -544 -2256 -544 2
LINE Normal -2256 -544 -2256 -544 2
LINE Normal -2256 -480 -2256 -480 2
LINE Normal -2256 -480 -2256 -480 2
LINE Normal -2176 592 -2176 592 2
LINE Normal -2176 592 -2176 592 2
LINE Normal -2256 368 -2256 368 2
LINE Normal -2256 368 -2256 368 2
LINE Normal -2176 576 -2176 576 2
LINE Normal -2176 576 -2176 576 2
LINE Normal -1680 1456 -1680 1312 2
LINE Normal -1680 1456 -1680 1456 2
LINE Normal -1680 1456 -1680 1456 2
LINE Normal -1696 1440 -1680 1456 2
LINE Normal -1696 1440 -1696 1440 2
LINE Normal -1664 1440 -1680 1456 2
LINE Normal -2080 -1520 -2080 -1664 2
LINE Normal -2080 -1520 -2080 -1520 2
LINE Normal -2080 -1520 -2080 -1520 2
LINE Normal -2096 -1536 -2080 -1520 2
LINE Normal -2096 -1536 -2096 -1536 2
LINE Normal -2064 -1536 -2080 -1520 2
LINE Normal -2080 1792 -2080 1680 2
LINE Normal -2080 1792 -2080 1792 2
LINE Normal -2080 1792 -2080 1792 2
LINE Normal -2096 1776 -2080 1792 2
LINE Normal -2096 1776 -2096 1776 2
LINE Normal -2064 1776 -2080 1792 2
LINE Normal 2624 -1584 2016 -1584
LINE Normal 2624 -1584 2624 -1584 2
LINE Normal -1664 -1072 -1664 -1072 2
LINE Normal -1664 -1072 -1664 -1072 2
LINE Normal -1648 -1088 -1664 -1072 2
LINE Normal -1648 -1088 -1648 -1088 2
LINE Normal -1680 -1088 -1664 -1072 2
LINE Normal -1664 -1072 -1664 -1216 2
RECTANGLE Normal 2624 -1488 2016 -1616
RECTANGLE Normal 2624 -1248 2016 -1472 3
RECTANGLE Normal 2976 -1008 2640 -1584 2
RECTANGLE Normal 1600 -736 2976 -992 3
RECTANGLE Normal 2976 -1632 1600 -2608 4
RECTANGLE Normal 1568 -2000 928 -2608 2
RECTANGLE Normal 896 -2368 496 -2608 1
RECTANGLE Normal 2624 -1008 2016 -1232 3
RECTANGLE Normal 2000 -1008 1600 -1616 3
RECTANGLE Normal -1744 -1952 -2048 -2048 3
ARC Normal -2192 -1168 -2288 -1008 -2265 -1165 -2286 -1010 2
ARC Normal -2208 -976 -2112 -816 -2114 -818 -2135 -973 2
ARC Normal -1824 -976 -1920 -816 -1897 -973 -1918 -818 2
ARC Normal -1952 -528 -1856 -368 -1858 -370 -1879 -525 2
ARC Normal -1952 640 -1856 800 -1858 798 -1879 643 2
ARC Normal -2160 -256 -2256 -96 -2233 -253 -2254 -98 2
ARC Normal -2160 -448 -2256 -288 -2233 -445 -2254 -290 2
ARC Normal -2160 400 -2256 560 -2233 403 -2254 558 2
ARC Normal -2160 576 -2256 720 -2233 579 -2254 718 2
ARC Normal -2192 1056 -2096 1216 -2098 1214 -2119 1059 2
ARC Normal -1856 1056 -1952 1216 -1929 1059 -1950 1214 2
ARC Normal -2208 1264 -2304 1424 -2281 1267 -2302 1422 2
ARC Normal -2224 1456 -2320 1872 -2297 1459 -2318 1870 2
ARC Normal -2176 -1600 -2272 -1184 -2249 -1597 -2270 -1186 2
ARC Normal 192 1872 32 1968 34 1966 189 1945 2
ARC Normal 48 -1584 208 -1680 206 -1678 51 -1657 2
ARC Normal -1840 -1184 -1744 -1008 -1746 -1010 -1767 -1165 2
ARC Normal -1840 1248 -1744 1408 -1746 1406 -1767 1251 2
ARC Normal -1952 -352 -1856 -128 -1858 -130 -1879 -285 2
ARC Normal -1936 352 -1840 576 -1842 574 -1863 419 2
ARC Normal -1856 -1488 -1760 -1312 -1762 -1314 -1783 -1469 2
ARC Normal -1840 1600 -1744 1760 -1746 1758 -1767 1603 2

The netlist it stands for:
* amplifier_V2.1_diff.asc
RIOF1 din 0 36k
Q39 CQ39 din CQ35 0 MMPQ6700-NPN
Q33 CQ33 fin CQ35 0 MMPQ6700-NPN
Q40 CQ40 din CQ36 0 MMPQ6700-PNP
Q34 CQ34 fin CQ36 0 MMPQ6700-PNP
R37 0 BQ35 1.2k
Q35 CQ35 BQ35 EQ35 0 MMBTA42
Q36 CQ36 BQ36 EQ36 0 MMBTA92
R38 BQ36 0 1.2k
VG1 in1 0 SINE(0 {VPin} {freq} {startsigndelay}) AC {VPin}
CF5 +HV 0 100n
D38 +RLV CD36 D1N4148
D35 BQ35 CD35 D1N4148
CF1 +HV 0 470µ
CF6 -HV 0 100n
CF2 0 -HV 470µ
CF33 +RLV 0 100n
CF31 +RLV 0 220µ
CF34 -RLV 0 100n
CF32 0 -RLV 220µ
CAI1 in1 din 47µ
VPHV N003 0 {PHV}
VPLV N004 0 {PLV}
VNHV N005 0 {NHV}
VNLV N006 0 {NLV}
VPRLV +RLV 0 {PRLV}
VNRLV -RLV 0 {NRLV}
Q37 POS_DIFF_OUT +RLV CQ39 0 MMBTA42
R35 +HVF MIDC1 15k
Q38 NEG_DIFF_OUT -RLV CQ40 0 MMBTA92
R36 MIDC2 -HVF 15k
Vripple4 -LV N006 PULSE({ripple_amp_L_C} 0 0 1m 9m 0 10m)
Vripple3 -HV N005 PULSE({ripple_amp_H_C} 0 0 1m 9m 0 10m)
Vripple1 N003 +HV PULSE({ripple_amp_H_C} 0 0 1m 9m 0 10m)
Vripple2 N004 +LV PULSE({ripple_amp_L_C} 0 0 1m 9m 0 10m)
D37 CD35 -RLV D1N4148
D36 CD36 BQ36 D1N4148
Q31 CQ31 +RLV CQ33 0 MMBTA42
R31 +HVF CQ31 16k
Q32 CQ32 -RLV CQ34 0 MMBTA92
R32 CQ32 -HVF 16k
D§LED2 +LV N002 YELLOW_LED
RL2 N002 -LV 5.6k
D§LED1 +HV N001 GREEN_LED
RL1 N001 -HV 20k
RF2 -HV -HVF 15
CF10 0 -HVF 470µ
RF1 +HV +HVF 15
CF9 +HVF 0 470µ
XRV1 RV1M EQ35 RV1M Rtot=100 wiper=0.2975 Rtap=0 tap=0.5
R33 RV1M -RLV 150
XRV2 RV2M EQ36 RV2M Rtot=100 wiper=0.6465 Rtap=0 tap=0.5
R34 +RLV RV2M 150
CF11 +HVF 0 100n
CF12 -HVF 0 100n
XRVC1 POS_DIFF_OUT MIDC1 POS_DIFF_OUT Rtot=2k wiper={bias_adj} Rtap=0 tap=0.5
XRVC2 NEG_DIFF_OUT MIDC2 NEG_DIFF_OUT Rtot=2k wiper={bias_adj} Rtap=0 tap=0.5
VG2 in2 0 SINE(0 {VPin2} {freq} {startsigndelay}) AC {VPin2}
CAI12 in2 fin 47µ
RIOF2 fin 0 36k
.model D D
.lib standard.dio
.model NPN NPN
.model PNP PNP
.lib standard.bjt
* Diferencia de corrientes
* Diferencia de corrientes
.lib MBR1645.lib
.lib MJE340.lib
.lib MJE350.lib
.lib D1N4148.lib
.lib MMBTA42.lib
.lib MMBTA92.lib
.lib MMPQ6700.lib
.param PHV=+{HV} PLV=+{LV} NHV=-{HV}
.param HV={if {SUPMODE == 0, LINELEVEL*SQRT(2)*HTRAFOEFF - DIODESDROPH, PREGHLAB}}
.param LV={if {SUPMODE == 0, LINELEVEL*SQRT(2)*LTRAFOEFF - DIODESDROPL, PREGLLAB}}
.param RLV=5
.param NLV=-{LV} PRLV={RLV} NRLV=-{RLV}
.param HTRAFOEFF=36
.param LTRAFOEFF=12
.param LINELEVEL={NORMALLINELEVEL}
* Tensión de línea(220V):
* 180V a 240V => 0.8 a 1.1
.param MAXLINELEVEL=1.1
.param MINLINELEVEL=0.8
.lib D1N4371.lib
.param NORMALLINELEVEL=1
.param SUPMODE={PS}
.param PREGHLAB=30
.param PREGLLAB=15
.param CComp1=10n
.param CComp3N=68p
.param CComp4=100p
* Compensación
.param CComp3P=68p
.param CComp5=1.2p
.param CComp2=6.8n
.lib D1N969B.lib
.param DIODESDROPH=1.1
.param DIODESDROPL=1.2
.param ripple_amp_H_C={if {SUPMODE == 0, {ripple_amp_H}, 0}}
.param ripple_amp_L_C={if {SUPMODE == 0, {ripple_amp_L}, 0}}
.param ripple_amp_H=2.21
.param ripple_amp_L=1.1
.param PS=0
.param PSLAB=1
* 1/2 W
* 1 W
.lib LEDS.lib
* 1%
* 1%
* 100V
* 100V
* 100V
* 100V
* 100V
* 100V
* 100V
* 100V
* 16V
* 50V
* 16V
* 50V
.lib MPSA42.lib
.lib MPSA92.lib
* 1%
* 1%
* 1%
.param bias_adj=0.39
.option plotwinsize=0
.option numdgt=9
* .tran 0 {tsim} 0 0.0001m
* 35V
* 35V
* 1%
.param freq=35k
.ac dec 10000 0.01 10G
.param VPin=1
.param startdelay=5m
.param startsigndelay=5m
.param dataduration=8m
.param datastep=0.0001m
.param VPin2=+1*{VPin}
.backanno
.end